# Altium schematic sheet CPU.SchDoc
size 381 x 381 mm
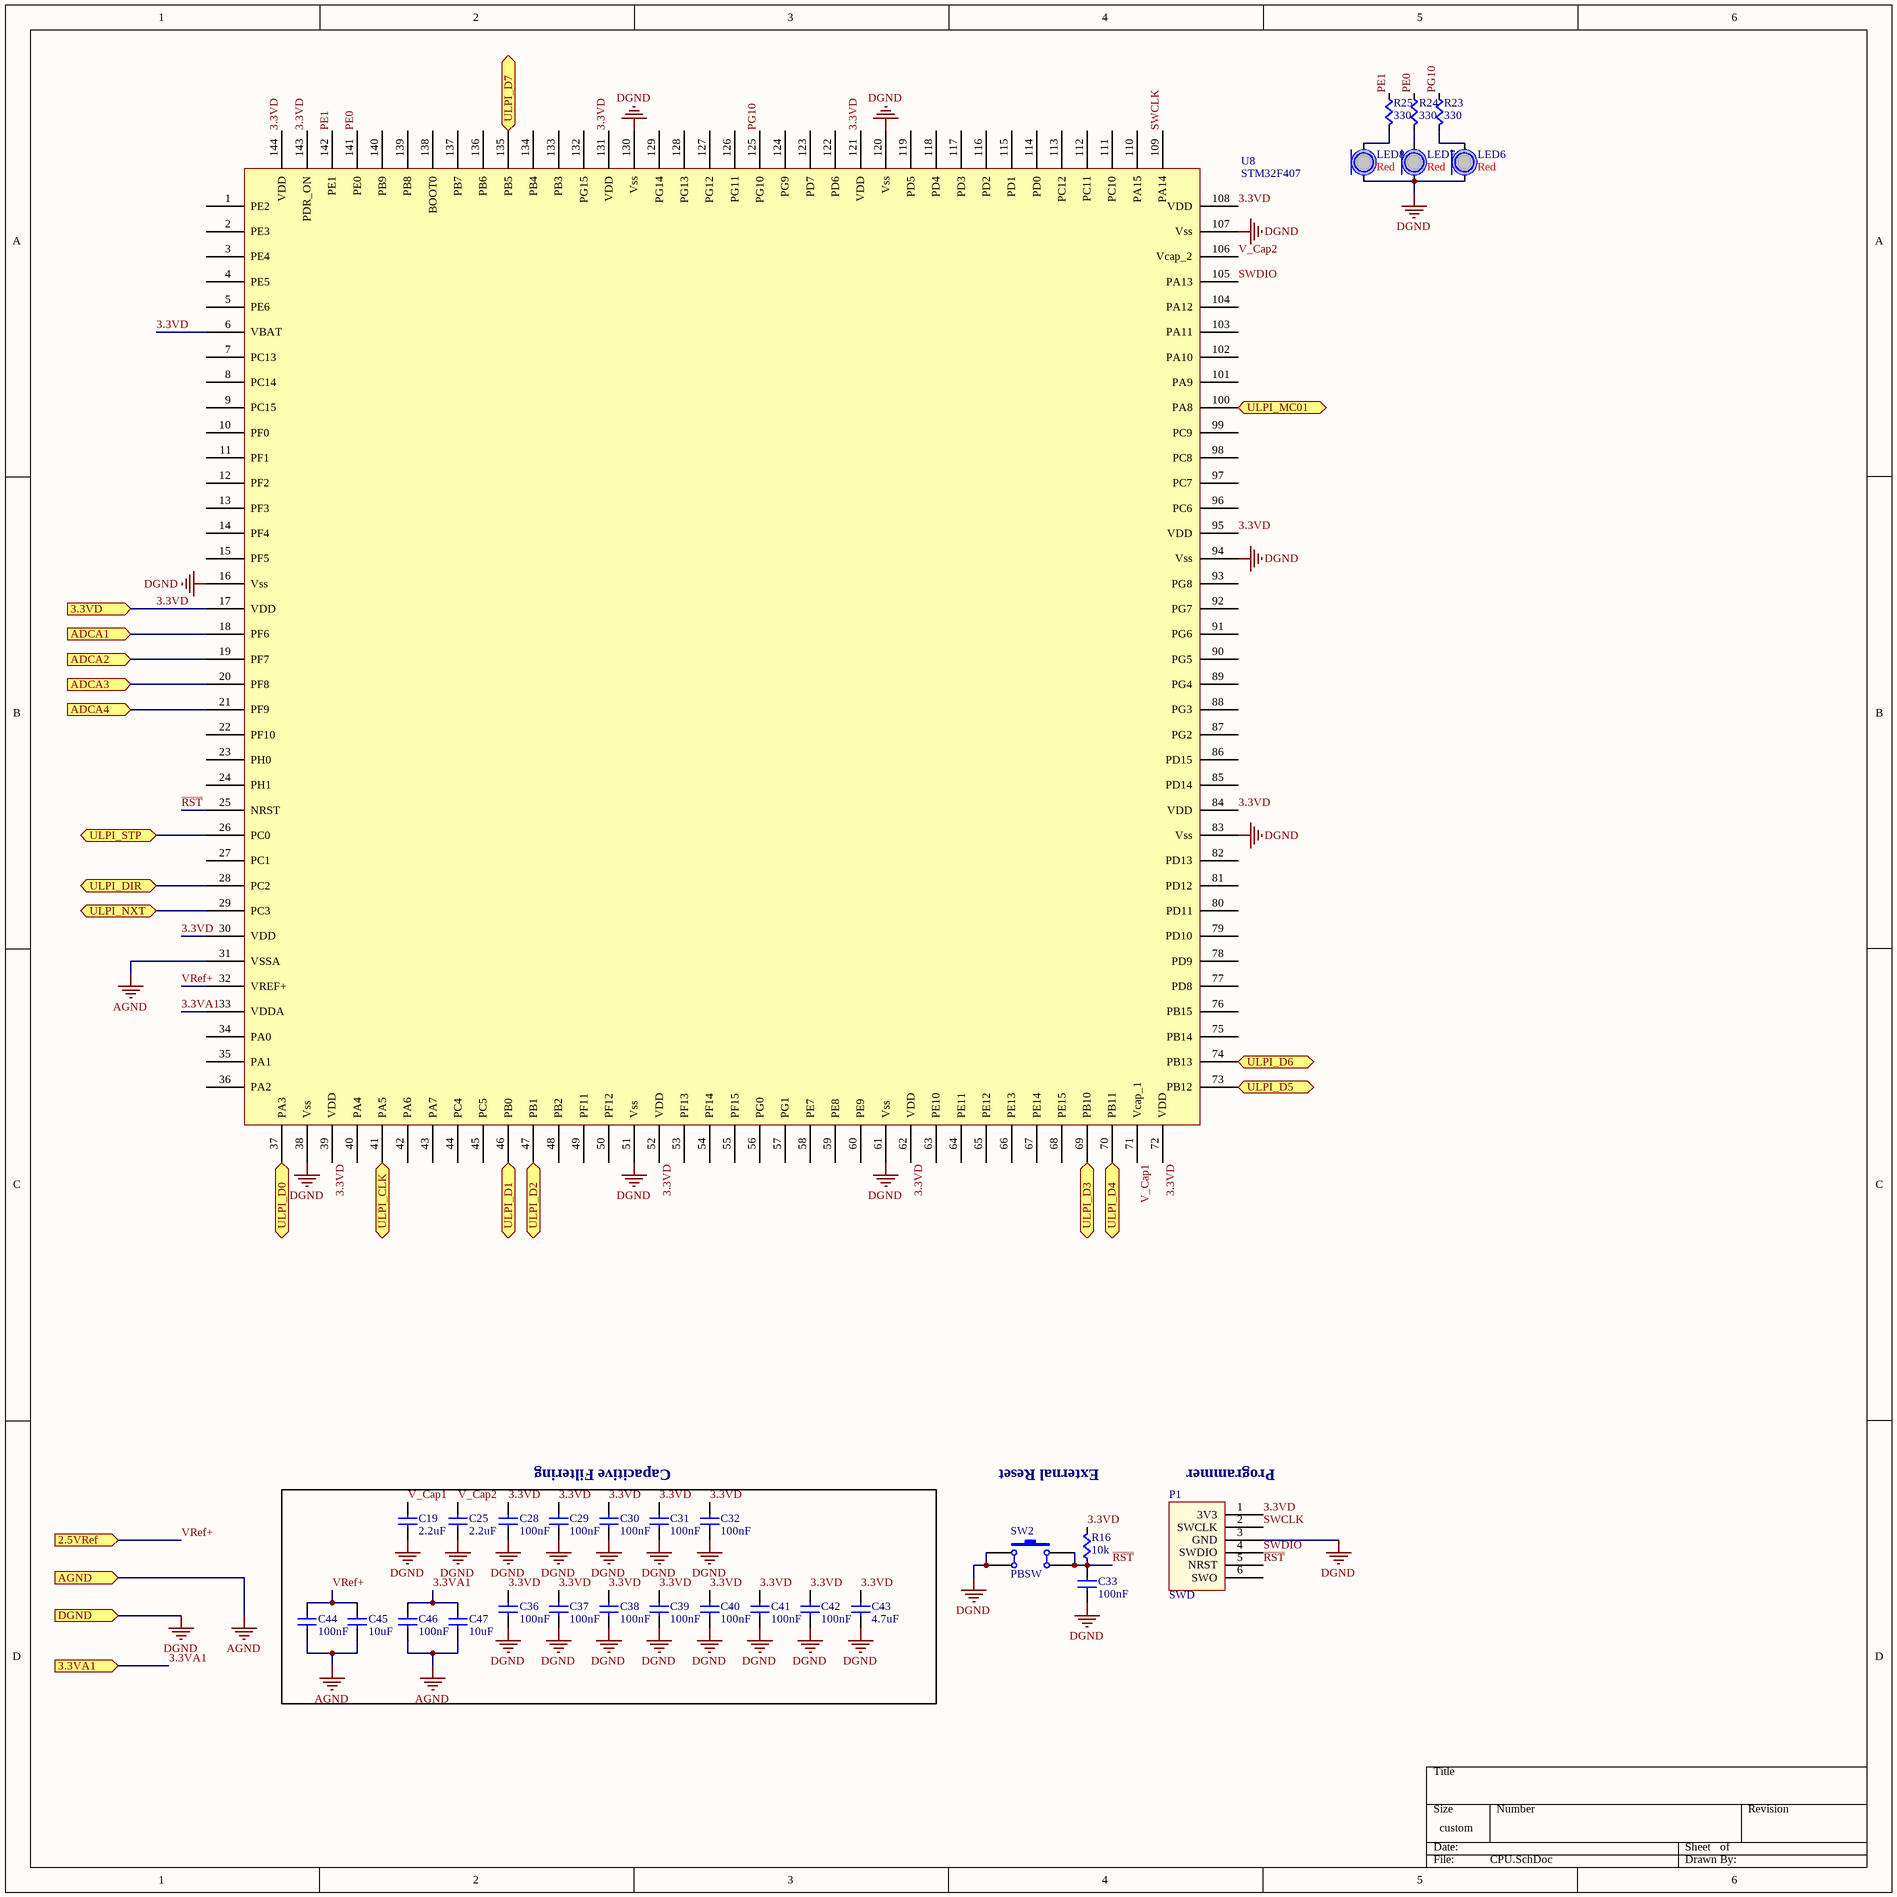
[diagram p0: CPU.SchDoc]

## Parts
C19  value 2.2uF  [CAPC0603]  (hidden comment: Cap)
C25  value 2.2uF  [CAPC0603]  (hidden comment: Cap)
C28  value 100nF  [CAPC0603]  (hidden comment: Cap)
C29  value 100nF  [CAPC0603]  (hidden comment: Cap)
C30  value 100nF  [CAPC0603]  (hidden comment: Cap)
C31  value 100nF  [CAPC0603]  (hidden comment: Cap)
C32  value 100nF  [CAPC0603]  (hidden comment: Cap)
C33  value 100nF  [CAPC0603]  (hidden comment: Cap)
C36  value 100nF  [CAPC0603]  (hidden comment: Cap)
C37  value 100nF  [CAPC0603]  (hidden comment: Cap)
C38  value 100nF  [CAPC0603]  (hidden comment: Cap)
C39  value 100nF  [CAPC0603]  (hidden comment: Cap)
C40  value 100nF  [CAPC0603]  (hidden comment: Cap)
C41  value 100nF  [CAPC0603]  (hidden comment: Cap)
C42  value 100nF  [CAPC0603]  (hidden comment: Cap)
C43  value 4.7uF  [CAPC0603]  (hidden comment: Cap)
C44  value 100nF  [CAPC0603]  (hidden comment: Cap)
C45  value 10uF  [CAPC0603]  (hidden comment: Cap)
C46  value 100nF  [CAPC0603]  (hidden comment: Cap)
C47  value 10uF  [CAPC0603]  (hidden comment: Cap)
LED6  Color: Red  [LED0603]  (hidden comment: LED)
LED7  Color: Red  [LED0603]  (hidden comment: LED)
LED8  Color: Red  [LED0603]  (hidden comment: LED)
P1  SWD  [SWD_STM32]
R16  value 10k  [RES0603]  (hidden comment: Res)
R23  value 330  [RES0603]  (hidden comment: Res)
R24  value 330  [RES0603]  (hidden comment: Res)
R25  value 330  [RES0603]  (hidden comment: Res)
SW2  PBSW  [PBSW]
U8  STM32F407  [LQFP-144]

## Ports
2.5VRef (in), 3.3VA1 (in), 3.3VD (in), ADCA1 (in), ADCA2 (in), ADCA3 (in), ADCA4 (in), AGND (in), DGND (in), ULPI_CLK (bidir), ULPI_D0 (bidir), ULPI_D1 (bidir), ULPI_D2 (bidir), ULPI_D3 (bidir), ULPI_D4 (bidir), ULPI_D5 (bidir), ULPI_D6 (bidir), ULPI_D7 (bidir), ULPI_DIR (bidir), ULPI_MC01 (bidir), ULPI_NXT (bidir), ULPI_STP (bidir)

## Nets
1: SW2.2(A')
3: SW2.4(B')
AGND: C44.2(B) C45.2(B) C46.2(B) C47.2(B) U8.31(VSSA) ; port AGND
DGND: C19.2(B) C25.2(B) C28.2(B) C29.2(B) C30.2(B) C31.2(B) C32.2(B) C33.2(B) C36.2(B) C37.2(B) C38.2(B) C39.2(B) C40.2(B) C41.2(B) C42.2(B) C43.2(B) LED6.C LED7.C LED8.C P1.3(GND) SW2.1(A) SW2.2(A') U8.16(Vss) U8.38(Vss) U8.51(Vss) U8.61(Vss) U8.83(Vss) U8.94(Vss) U8.107(Vss) U8.120(Vss) U8.130(Vss) ; port DGND
3.3VA1: C46.1(A) C47.1(A) U8.33(VDDA) ; port 3.3VA1
3.3VD: C28.1(A) C29.1(A) C30.1(A) C31.1(A) C32.1(A) C36.1(A) C37.1(A) C38.1(A) C39.1(A) C40.1(A) C41.1(A) C42.1(A) C43.1(A) P1.1(3V3) R16.1(A) U8.6(VBAT) U8.17(VDD) U8.30(VDD) U8.39(VDD) U8.52(VDD) U8.62(VDD) U8.72(VDD) U8.84(VDD) U8.95(VDD) U8.108(VDD) U8.121(VDD) U8.131(VDD) U8.143(PDR_ON) U8.144(VDD) ; port 3.3VD
ADCA1: U8.18(PF6) ; port ADCA1
ADCA2: U8.19(PF7) ; port ADCA2
ADCA3: U8.20(PF8) ; port ADCA3
ADCA4: U8.21(PF9) ; port ADCA4
PE0: R24.2(B) U8.141(PE0)
PE1: R25.2(B) U8.142(PE1)
PG10: R23.2(B) U8.125(PG10)
~{RST}: C33.1(A) P1.5(NRST) R16.2(B) SW2.3(B) SW2.4(B') U8.25(NRST)
SWCLK: P1.2(SWCLK) U8.109(PA14)
SWDIO: P1.4(SWDIO) U8.105(PA13)
ULPI_CLK: U8.41(PA5) ; port ULPI_CLK
ULPI_D0: U8.37(PA3) ; port ULPI_D0
ULPI_D1: U8.46(PB0) ; port ULPI_D1
ULPI_D2: U8.47(PB1) ; port ULPI_D2
ULPI_D3: U8.69(PB10) ; port ULPI_D3
ULPI_D4: U8.70(PB11) ; port ULPI_D4
ULPI_D5: U8.73(PB12) ; port ULPI_D5
ULPI_D6: U8.74(PB13) ; port ULPI_D6
ULPI_D7: U8.135(PB5) ; port ULPI_D7
ULPI_DIR: U8.28(PC2) ; port ULPI_DIR
ULPI_MC01: U8.100(PA8) ; port ULPI_MC01
ULPI_NXT: U8.29(PC3) ; port ULPI_NXT
ULPI_STP: U8.26(PC0) ; port ULPI_STP
V_Cap1: C19.1(A) U8.71(Vcap_1)
V_Cap2: C25.1(A) U8.106(Vcap_2)
VRef+: C44.1(A) C45.1(A) U8.32(VREF+) ; port 2.5VRef
NetLED6_A: LED6.A R23.1(A)
NetLED7_A: LED7.A R24.1(A)
NetLED8_A: LED8.A R25.1(A)

Not connected (* = marked no-connect by the designer): P1 6(SWO); U8 1(PE2) 2(PE3) 3(PE4) 4(PE5) 5(PE6) 7(PC13) 8(PC14) 9(PC15) 10(PF0) 11(PF1) 12(PF2) 13(PF3) 14(PF4) 15(PF5) 22(PF10) 23(PH0) 24(PH1) 27(PC1) 34(PA0) 35(PA1) 36(PA2) 40(PA4) 42(PA6) 43(PA7) 44(PC4) 45(PC5) 48(PB2) 49(PF11) 50(PF12) 53(PF13) 54(PF14) 55(PF15) 56(PG0) 57(PG1) 58(PE7) 59(PE8) 60(PE9) 63(PE10) 64(PE11) 65(PE12) 66(PE13) 67(PE14) 68(PE15) 75(PB14) 76(PB15) 77(PD8) 78(PD9) 79(PD10) 80(PD11) 81(PD12) 82(PD13) 85(PD14) 86(PD15) 87(PG2) 88(PG3) 89(PG4) 90(PG5) 91(PG6) 92(PG7) 93(PG8) 96(PC6) 97(PC7) 98(PC8) 99(PC9) 101(PA9) 102(PA10) 103(PA11) 104(PA12) 110(PA15) 111(PC10) 112(PC11) 113(PC12) 114(PD0) 115(PD1) 116(PD2) 117(PD3) 118(PD4) 119(PD5) 122(PD6) 123(PD7) 124(PG9) 126(PG11) 127(PG12) 128(PG13) 129(PG14) 132(PG15) 133(PB3) 134(PB4) 136(PB6) 137(PB7) 138(BOOT0) 139(PB8) 140(PB9)

## Notes on the sheet
- Capacitive Filtering
- External Reset
- (near P1) Programmer

## Library data of the parts
P1 = SWD_STM32: SWD connector matching the pinout on STM Discovery Boards
SW2 = SW-PB: Push Button Switch; Manufacturer: Panasonic Electronic Components; Manufacturer Part Number: EVQ-9P105M; Outline: 6.10mm x 6.00mm; Actuator Orientation: Top Actuated; Actuator Height off PCB, from Pins: 5.00mm; Published: 24-Mar-1999; LatestRevisionDate: 17-Jul-2002; LatestRevisionNote: Re-released for DXP Platform.; PackageReference: SPST-2; Publisher: Altium Limited; PackageDescription: Switch; 2 Leads; Supplier 1: Digi-Key; Supplier Part Number 1: P13586SCT-ND
U8 = STM32F407ZGT6: IC MCU 32BIT 1MB FLASH 144LQFP; Supplier 1: Digi-Key; Supplier Part Number 1: 497-11766-ND
C19 C25 C28-C33 C36-C47 = Cap: Supplier 1: Digi-Key; Supplier Part Number 1: 1276-1000-1-ND
LED6-LED8 = LED: Supplier 1: Digi-Key; Supplier Part Number 1: 754-1122-1-ND
R16 R23-R25 = Res: Supplier 1: Digi-Key; Supplier Part Number 1: RMCF0603JT10K0CT-ND